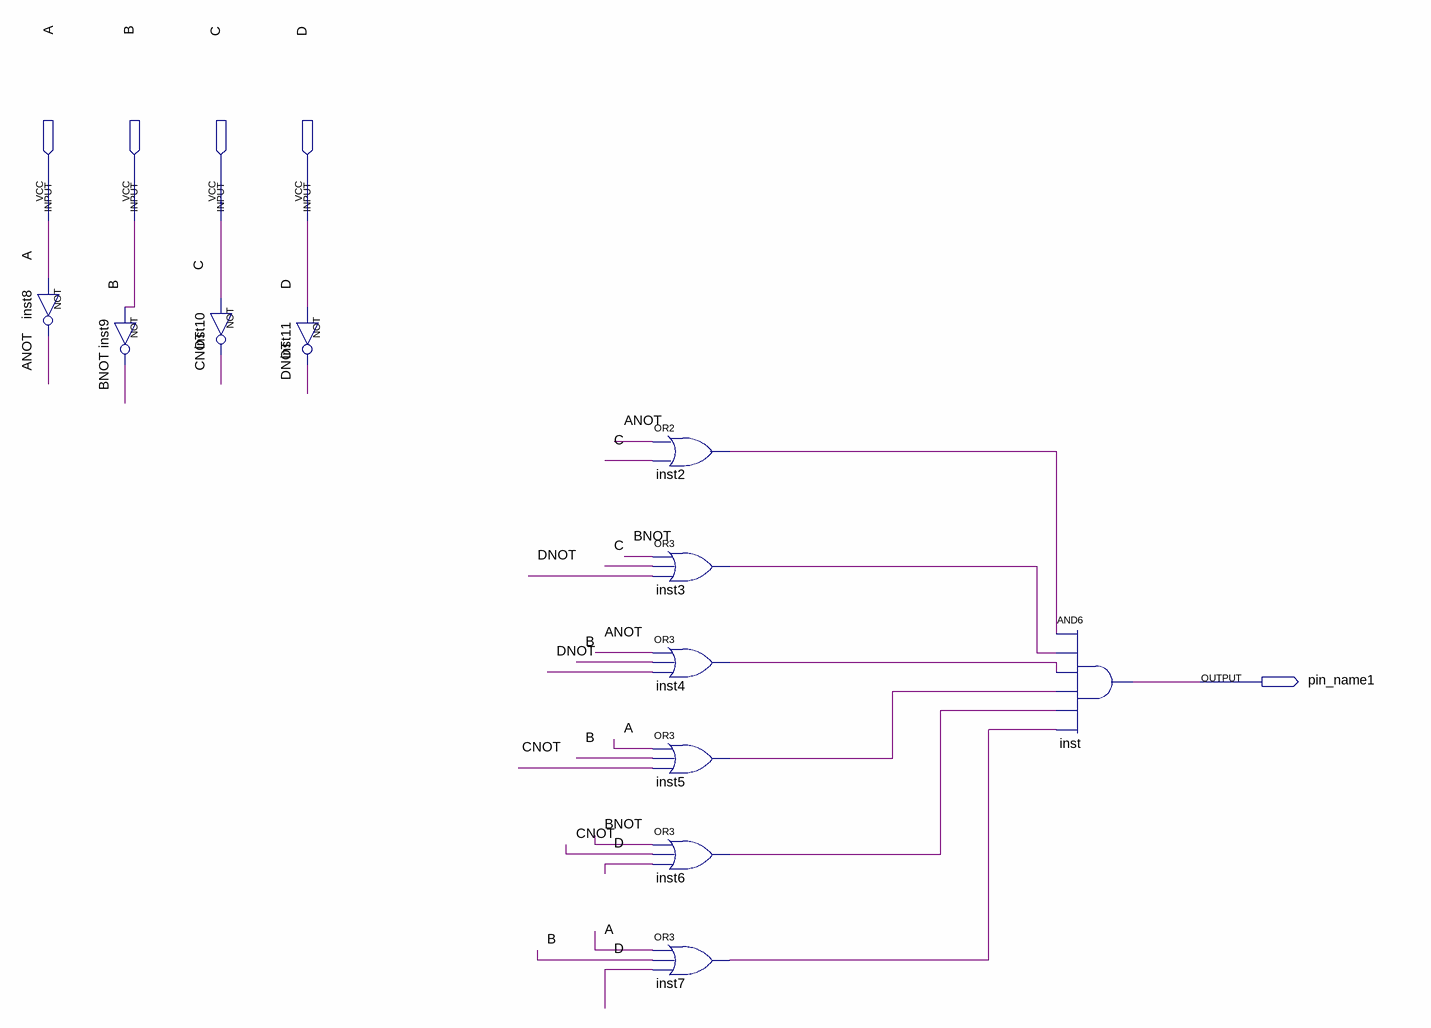
[diagram p0: schematic sheet]
// Quartus schematic output3.bdf as structural Verilog: 11 symbols, 5 pins
module output3 (
  input  A,
  input  B,
  input  C,
  input  D,
  output pin_name1
);

  wire ANOT, BNOT, CNOT, DNOT, inst2_out, inst3_out, inst4_out, inst5_out, inst6_out, inst7_out;

  not inst8 (ANOT, A);
  not inst9 (BNOT, B);
  not inst10 (CNOT, C);
  not inst11 (DNOT, D);
  or inst2 (inst2_out, ANOT, C);
  or inst3 (inst3_out, BNOT, C, DNOT);
  or inst4 (inst4_out, ANOT, B, DNOT);
  or inst5 (inst5_out, A, B, CNOT);
  or inst6 (inst6_out, BNOT, CNOT, D);
  or inst7 (inst7_out, A, B, D);
  and inst (pin_name1, inst2_out, inst3_out, inst4_out, inst5_out, inst6_out, inst7_out);
endmodule
